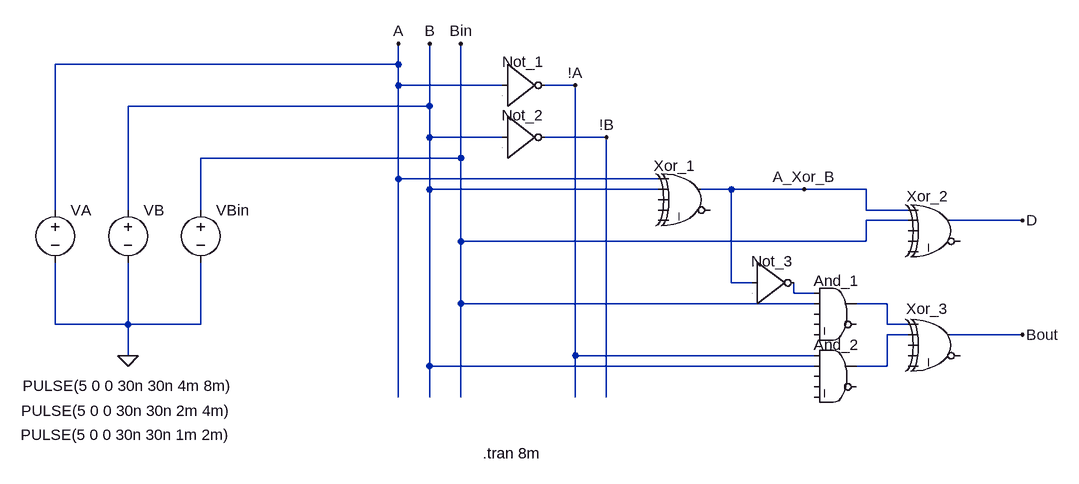
[diagram p0: schematic Full Substractor 4 Bits.asc]
Full Substractor 4 Bits.asc, the LTspice schematic file:
Version 4
SHEET 1 880 680
WIRE -352 -32 -352 -64
WIRE -352 -32 -880 -32
WIRE -352 0 -352 -32
WIRE -192 0 -352 0
WIRE -80 0 -128 0
WIRE -304 32 -304 -64
WIRE -304 32 -768 32
WIRE -304 80 -304 32
WIRE -192 80 -304 80
WIRE -32 80 -128 80
WIRE -256 112 -256 -64
WIRE -256 112 -656 112
WIRE -352 144 -352 0
WIRE 48 144 -352 144
WIRE -304 160 -304 80
WIRE 48 160 -304 160
WIRE 160 160 112 160
WIRE 272 160 160 160
WIRE 368 160 272 160
WIRE -880 192 -880 -32
WIRE -768 192 -768 32
WIRE -656 192 -656 112
WIRE 368 192 368 160
WIRE 432 192 368 192
WIRE 432 208 368 208
WIRE 608 208 496 208
WIRE -256 240 -256 112
WIRE 368 240 368 208
WIRE 368 240 -256 240
WIRE 160 304 160 160
WIRE 192 304 160 304
WIRE 256 320 256 304
WIRE 288 320 256 320
WIRE -256 336 -256 240
WIRE 288 336 -256 336
WIRE 400 336 352 336
WIRE -880 368 -880 272
WIRE -768 368 -768 272
WIRE -768 368 -880 368
WIRE -656 368 -656 272
WIRE -656 368 -768 368
WIRE 400 368 400 336
WIRE 432 368 400 368
WIRE 432 384 400 384
WIRE 608 384 496 384
WIRE -768 416 -768 368
WIRE -80 416 -80 0
WIRE 288 416 -80 416
WIRE -304 432 -304 160
WIRE 288 432 -304 432
WIRE 400 432 400 384
WIRE 400 432 352 432
WIRE -352 480 -352 144
WIRE -304 480 -304 432
WIRE -256 480 -256 336
WIRE -80 480 -80 416
WIRE -32 480 -32 80
FLAG -352 -64 A
FLAG -304 -64 B
FLAG -256 -64 Bin
FLAG -80 0 !A
FLAG -32 80 !B
FLAG 608 208 D
FLAG 608 384 Bout
FLAG 272 160 A_Xor_B
FLAG -768 416 0
SYMBOL Digital\\xor 96 112 R0
WINDOW 0 -55 12 Left 2
SYMATTR InstName Xor_1
SYMBOL Digital\\inv -192 -64 R0
WINDOW 0 0 28 Left 2
SYMATTR InstName Not_1
SYMBOL Digital\\inv -192 16 R0
WINDOW 0 -1 30 Left 2
SYMATTR InstName Not_2
SYMBOL Digital\\xor 480 160 R0
WINDOW 0 -50 11 Left 2
SYMATTR InstName Xor_2
SYMBOL Digital\\inv 192 240 R0
WINDOW 0 -1 31 Left 2
SYMATTR InstName Not_3
SYMBOL Digital\\and 320 288 R0
WINDOW 0 -33 13 Left 2
SYMATTR InstName And_1
SYMBOL Digital\\and 320 384 R0
WINDOW 0 -33 15 Left 2
SYMATTR InstName And_2
SYMBOL Digital\\xor 480 336 R0
WINDOW 0 -51 8 Left 2
SYMATTR InstName Xor_3
SYMBOL voltage -880 176 R0
WINDOW 3 -50 286 Left 2
WINDOW 123 0 0 Left 0
WINDOW 39 0 0 Left 0
SYMATTR InstName VA
SYMATTR Value PULSE(5 0 0 30n 30n 4m 8m)
SYMBOL voltage -768 176 R0
WINDOW 3 -164 325 Left 2
WINDOW 123 0 0 Left 0
WINDOW 39 0 0 Left 0
SYMATTR InstName VB
SYMATTR Value PULSE(5 0 0 30n 30n 2m 4m)
SYMBOL voltage -656 176 R0
WINDOW 3 -277 362 Left 2
WINDOW 123 0 0 Left 0
WINDOW 39 0 0 Left 0
SYMATTR InstName VBin
SYMATTR Value PULSE(5 0 0 30n 30n 1m 2m)
TEXT -222 566 Left 2 !.tran 8m

The netlist it stands for:
* Full Substractor 4 Bits.asc
A§Xor_1 A B 0 0 0 0 A_Xor_B 0 XOR
A§Not_1 A 0 0 0 0 !A 0 0 BUF
A§Not_2 B 0 0 0 0 !B 0 0 BUF
A§Xor_2 A_Xor_B Bin 0 0 0 0 D 0 XOR
A§Not_3 A_Xor_B 0 0 0 0 N001 0 0 BUF
And_1 N001 Bin 0 0 0 0 N002 0 AND
And_2 !A B 0 0 0 0 N003 0 AND
A§Xor_3 N002 N003 0 0 0 0 Bout 0 XOR
VA A 0 PULSE(5 0 0 30n 30n 4m 8m)
VB B 0 PULSE(5 0 0 30n 30n 2m 4m)
VBin Bin 0 PULSE(5 0 0 30n 30n 1m 2m)
.tran 8m
.backanno
.end

* Results of the author's LTspice run, read from the files saved beside the schematic
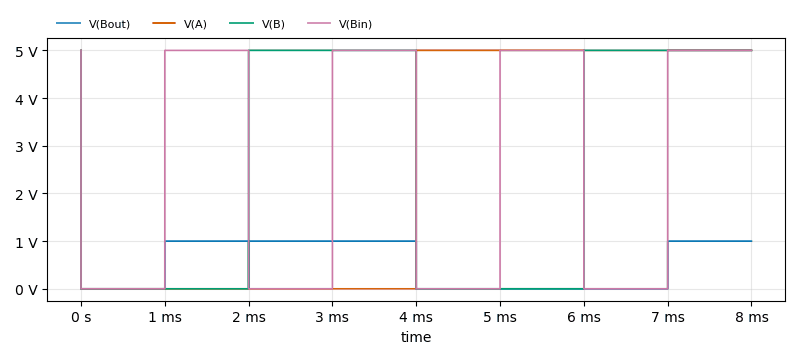
[diagram p1: Transient Analysis of Full Substractor 4 Bits.asc, plotted from the saved traces]
* Transient Analysis, 1 run:
*   V(Bout): min 0 V, max 1 V, average 500 mV, rms 707.1 mV, last 1 V
*   V(A): min 0 V, max 5 V, average 2.5 V, rms 3.536 V, last 5 V
*   V(B): min 0 V, max 5 V, average 2.5 V, rms 3.536 V, last 5 V
*   V(Bin): min 0 V, max 5 V, average 2.5 V, rms 3.535 V, last 5 V